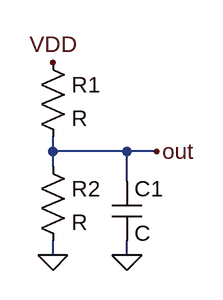
[diagram p0: schematic Draft2.asc]
Draft2.asc, the LTspice schematic file:
Version 4
SHEET 1 880 680
WIRE 176 176 176 160
WIRE 256 176 176 176
WIRE 288 176 256 176
WIRE 176 192 176 176
WIRE 256 208 256 176
WIRE 176 288 176 272
WIRE 256 288 256 272
FLAG 176 288 0
FLAG 256 288 0
FLAG 176 80 VDD
FLAG 288 176 out
SYMBOL res 160 64 R0
SYMATTR InstName R1
SYMBOL res 160 176 R0
SYMATTR InstName R2
SYMBOL cap 240 208 R0
SYMATTR InstName C1

The netlist it stands for:
* Draft2.asc
R1 VDD out R
R2 out 0 R
C1 out 0 C
.backanno
.end